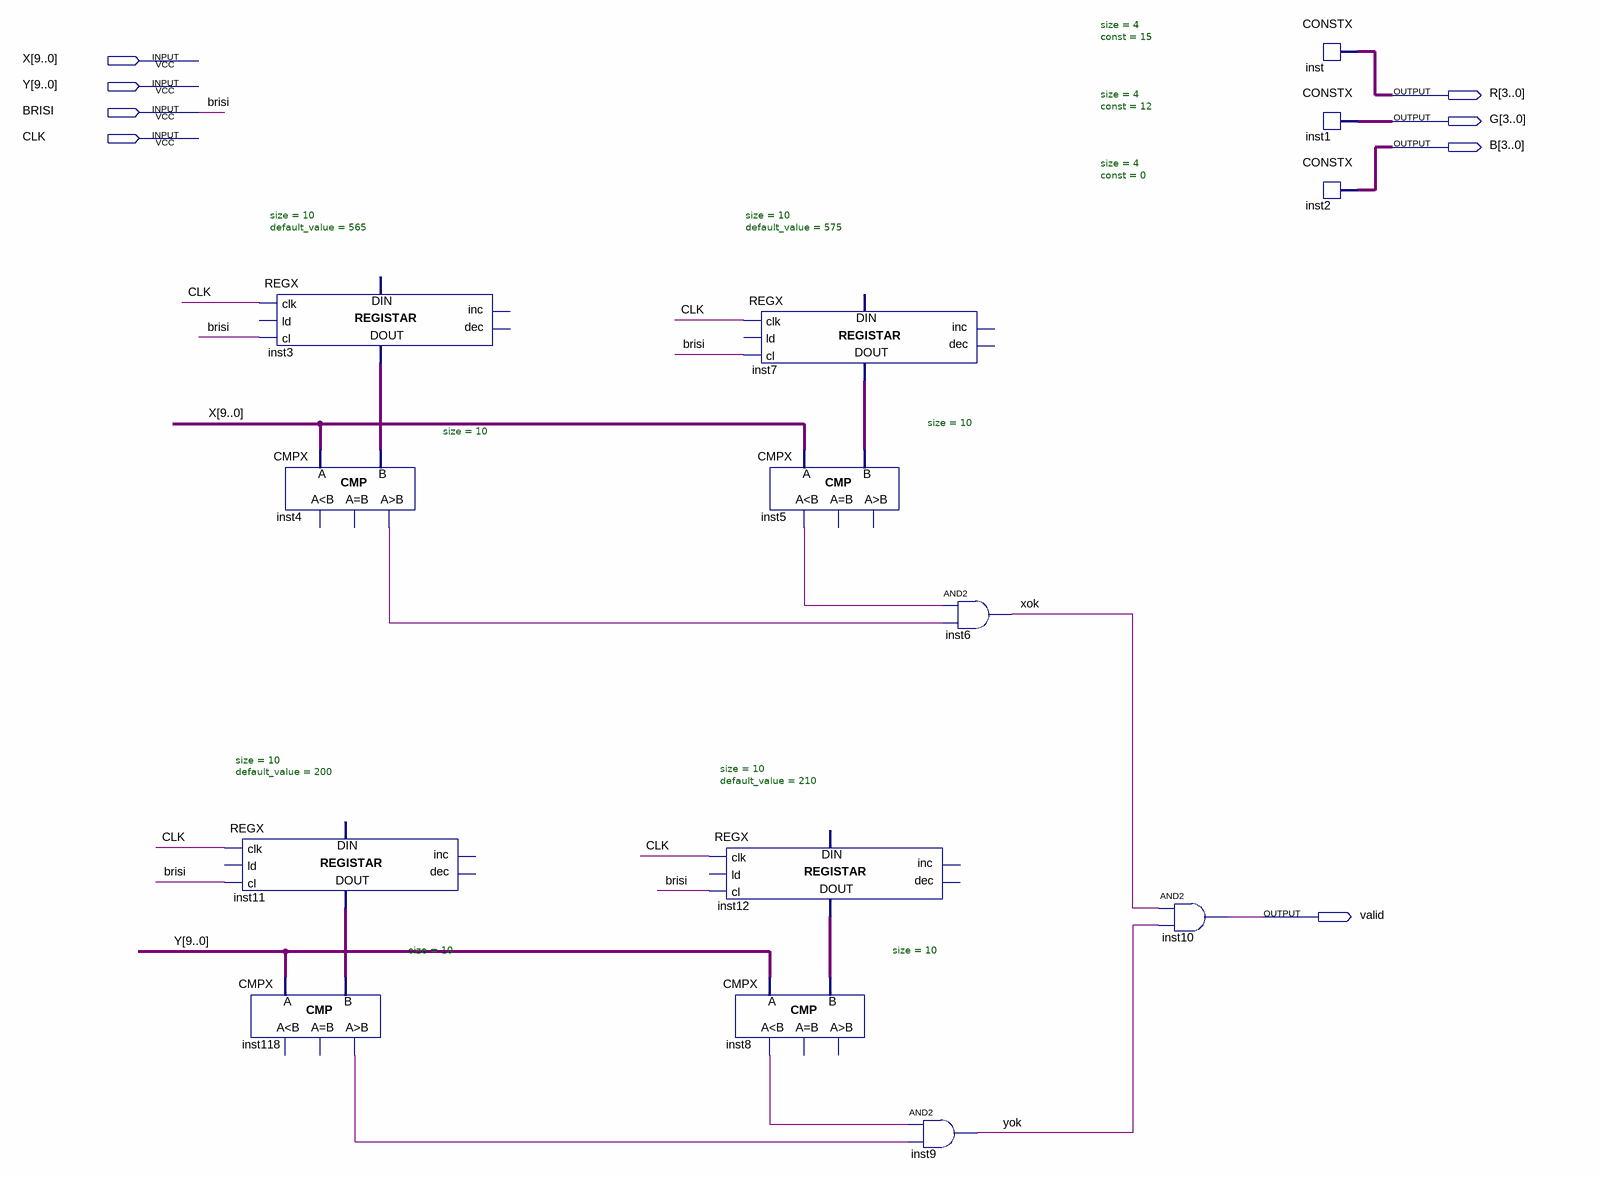
[diagram p0: schematic sheet]
// Quartus schematic novcic7.bdf as structural Verilog: 14 symbols, 8 pins
module novcic7 (
  input  [9:0] X,
  input  [9:0] Y,
  input  BRISI,
  input  CLK,
  output [3:0] R,
  output [3:0] G,
  output [3:0] B,
  output valid
);

  wire inst4_gr, inst5_ls, inst8_ls, inst118_gr, xok, yok;
  wire [9:0] inst3_data_out, inst7_data_out, inst11_data_out, inst12_data_out;

  REGX #(.size(10), .default_value(565)) inst3 (
    .clk(CLK), .cl(BRISI), .data_out(inst3_data_out));  // open: ld, inc, dec, data_in
  REGX #(.size(10), .default_value(200)) inst11 (
    .clk(CLK), .cl(BRISI), .data_out(inst11_data_out));  // open: ld, inc, dec, data_in
  CMPX #(.size(10)) inst118 (.A(Y), .B(inst11_data_out), .gr(inst118_gr));  // open: ls, eq
  CMPX #(.size(10)) inst4 (.A(X), .B(inst3_data_out), .gr(inst4_gr));  // open: ls, eq
  REGX #(.size(10), .default_value(575)) inst7 (
    .clk(CLK), .cl(BRISI), .data_out(inst7_data_out));  // open: ld, inc, dec, data_in
  REGX #(.size(10), .default_value(210)) inst12 (
    .clk(CLK), .cl(BRISI), .data_out(inst12_data_out));  // open: ld, inc, dec, data_in
  CMPX #(.size(10)) inst8 (.A(Y), .B(inst12_data_out), .ls(inst8_ls));  // open: eq, gr
  CMPX #(.size(10)) inst5 (.A(X), .B(inst7_data_out), .ls(inst5_ls));  // open: eq, gr
  and inst6 (xok, inst5_ls, inst4_gr);
  and inst9 (yok, inst8_ls, inst118_gr);
  and inst10 (valid, xok, yok);
  CONSTX #(.size(4), .\const (15)) inst (.data(R));
  CONSTX #(.size(4), .\const (12)) inst1 (.data(G));
  CONSTX #(.size(4), .\const (0)) inst2 (.data(B));
endmodule
